# Altium project PMSM_G474.PrjPcb
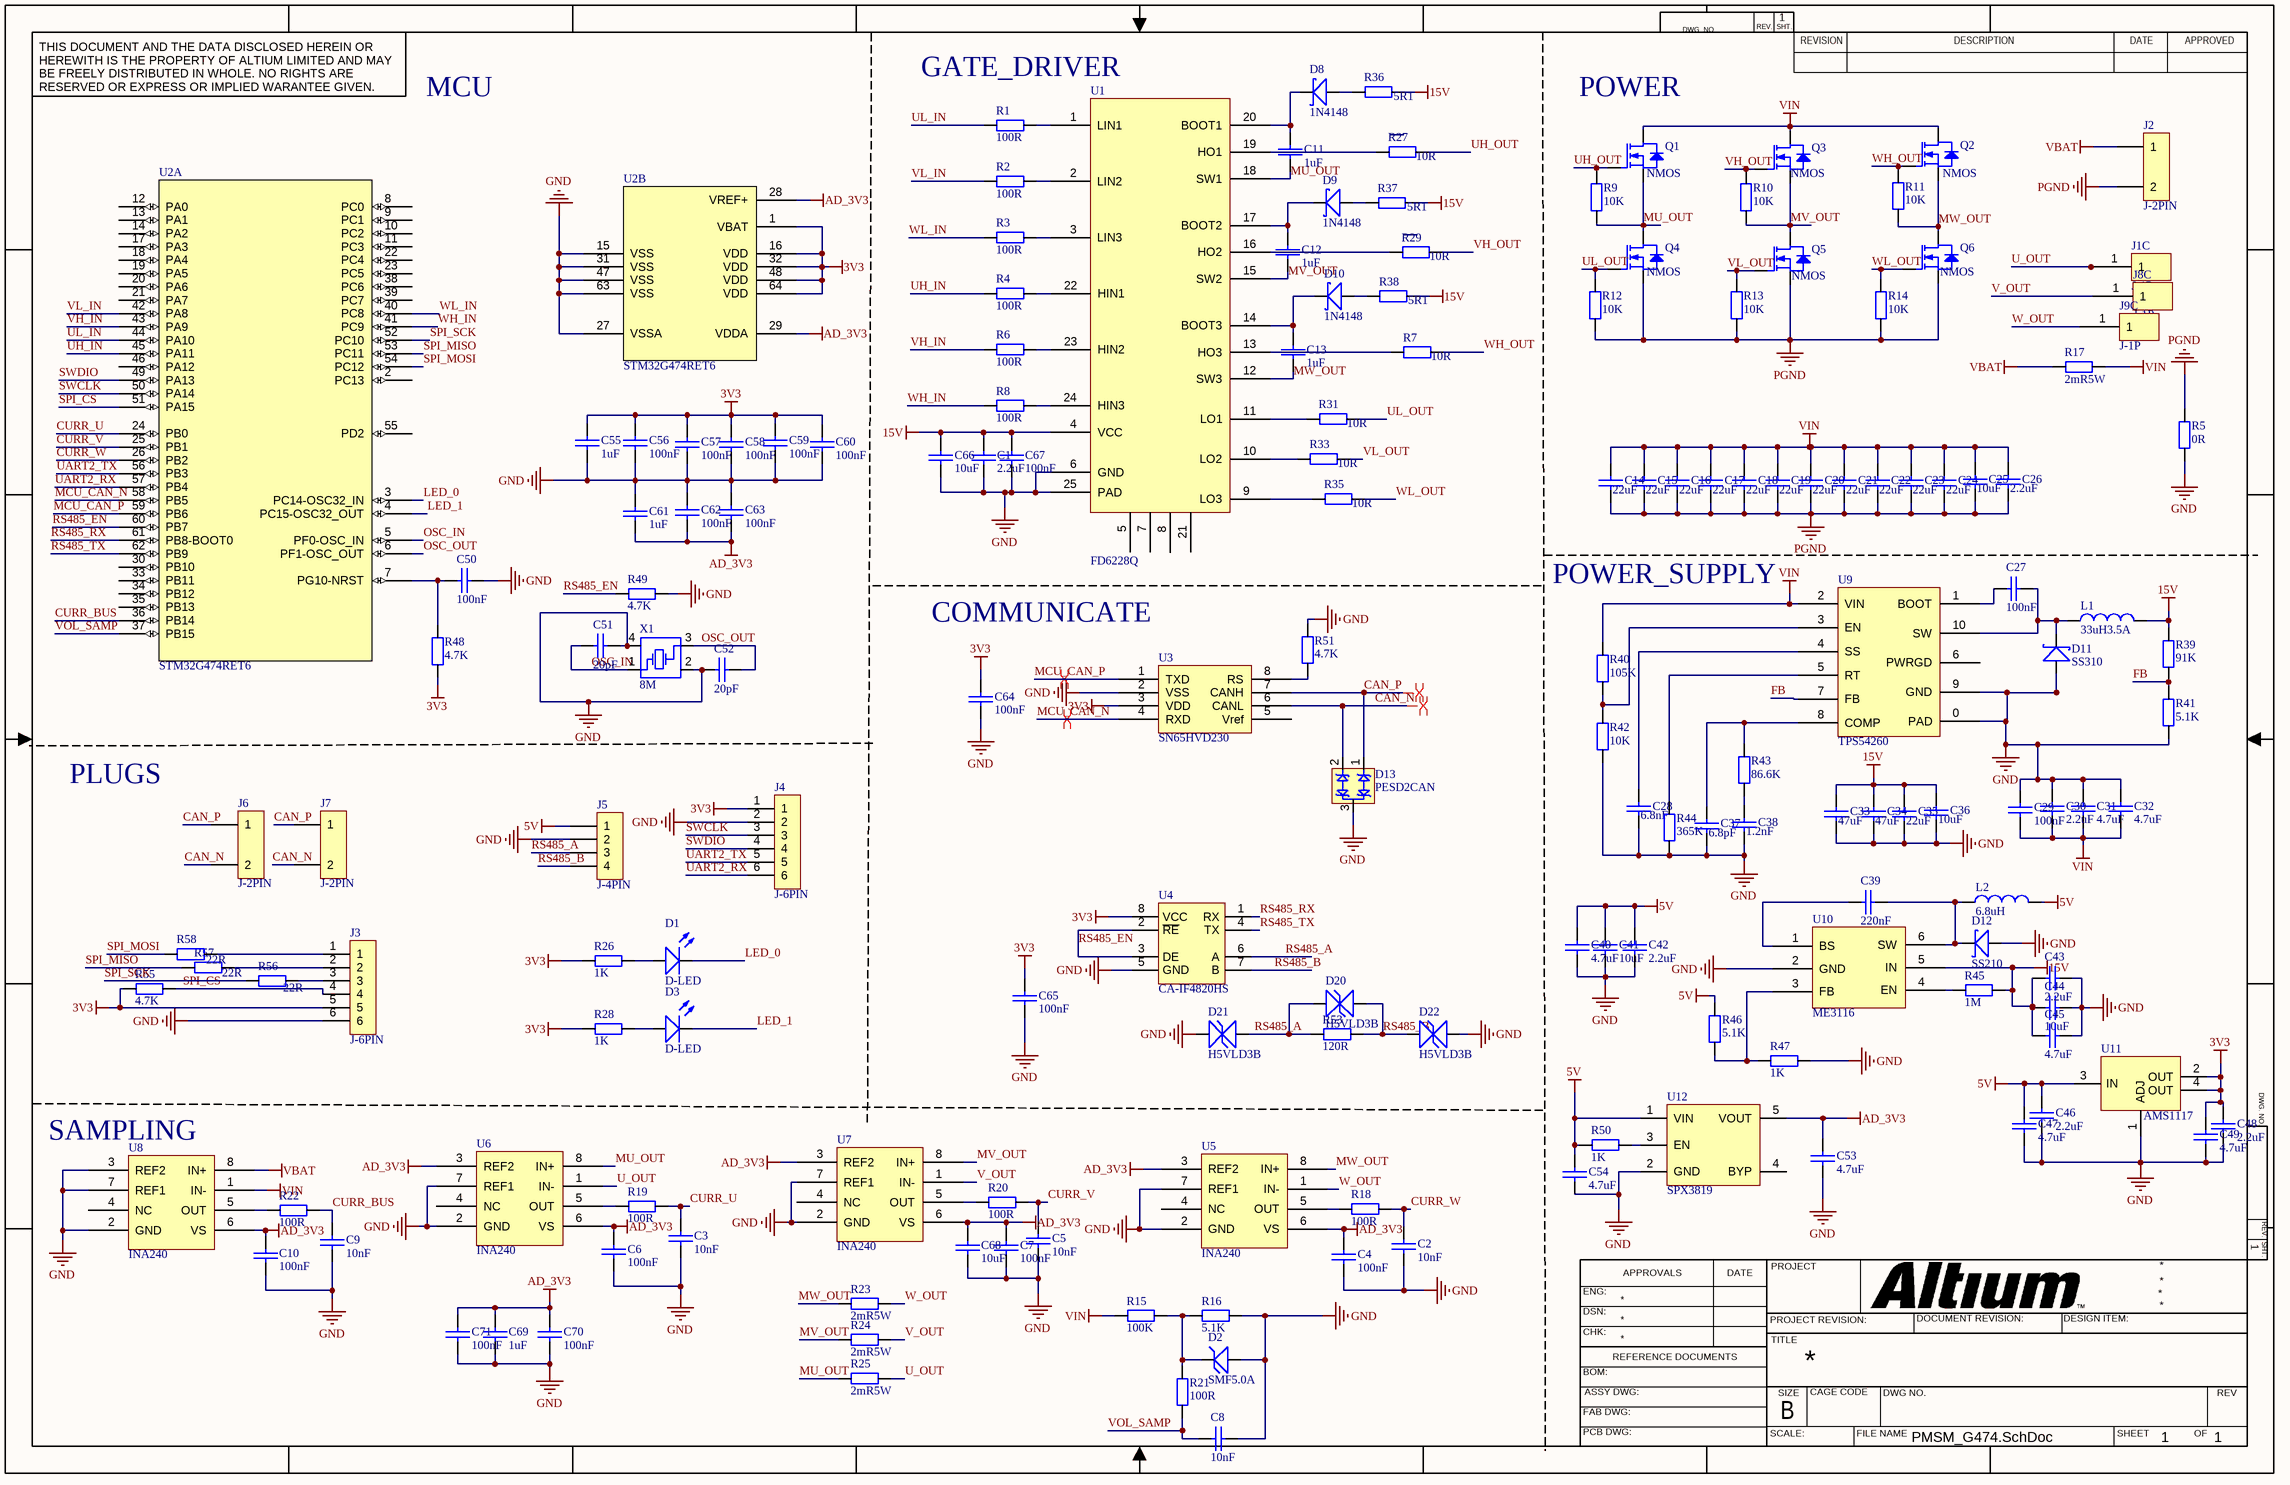
[diagram p0: PMSM_G474.SchDoc]
1 sheet, 166 parts. Net scope: global (net labels, ports and power ports of the same name join across sheets).
Board files: PMSM_G474.PcbDoc, PMSM_G474V1.0.PcbDoc

## Sheet PMSM_G474.SchDoc
size 431 x 279 mm; SheetNumber: 1; SheetTotal: 1

### Parts
C1  2.2uF  [C-0603]
C2  10nF  [C-0603]
C3  10nF  [C-0603]
C4  100nF  [C-0603]
C5  10nF  [C-0603]
C6  100nF  [C-0603]
C7  100nF  [C-0603]
C8  10nF  [C-0603]
C9  10nF  [C-0603]
C10  100nF  [C-0603]
C11  1uF  [C-0603]
C12  1uF  [C-0603]
C13  1uF  [C-0603]
C14  22uF  [C-1206]
C15  22uF  [C-1206]
C16  22uF  [C-1206]
C17  22uF  [C-1206]
C18  22uF  [C-1206]
C19  22uF  [C-1206]
C20  22uF  [C-1206]
C21  22uF  [C-1206]
C22  22uF  [C-1206]
C23  22uF  [C-1206]
C24  22uF  [C-1206]
C25  10uF  [C-1206]
C26  2.2uF  [C-1206]
C27  100nF  [C-0603]
C28  6.8nF  [C-0603]
C29  100nF  [C-0603]
C30  2.2uF  [C-1206]
C31  4.7uF  [C-1206]
C32  4.7uF  [C-1206]
C33  47uF  [C-1206]
C34  47uF  [C-1206]
C35  22uF  [C-1206]
C36  10uF  [C-1206]
C37  6.8pF  [C-0603]
C38  1.2nF  [C-0603]
C39  220nF  [C-0603]
C40  4.7uF  [C-1206]
C41  10uF  [C-1206]
C42  2.2uF  [C-1206]
C43  2.2uF  [C-1206]
C44  10uF  [C-1206]
C45  4.7uF  [C-1206]
C46  2.2uF  [C-0603]
C47  4.7uF  [C-0603]
C48  2.2uF  [C-0603]
C49  4.7uF  [C-0603]
C50  100nF  [C-0603]
C51  20pF  [C-0603]
C52  20pF  [C-0603]
C53  4.7uF  [C-0603]
C54  4.7uF  [C-0603]
C55  1uF  [C-0603]
C56  100nF  [C-0603]
C57  100nF  [C-0603]
C58  100nF  [C-0603]
C59  100nF  [C-0603]
C60  100nF  [C-0603]
C61  1uF  [C-0603]
C62  100nF  [C-0603]
C63  100nF  [C-0603]
C64  100nF  [C-0603]
C65  100nF  [C-0603]
C66  10uF  [C-0603]
C67  100nF  [C-0603]
C68  10uF  [C-0603]
C69  1uF  [C-0603]
C70  100nF  [C-0603]
C71  100nF  [C-0603]
D1  D-LED  [D-LED-0603Blue]
D2  SMF5.0A  [D-SOD-123]
D3  D-LED  [D-LED-0603Blue]
D8  1N4148  [D-SOD-123]
D9  1N4148  [D-SOD-123]
D10  1N4148  [D-SOD-123]
D11  SS310  [DO-214AC(SMA)]
D12  SS210  [DO-214AC(SMA)]
D13  PESD2CAN  [SOT-233]
D20  H5VLD3B  [D-SOD-323]
D21  H5VLD3B  [D-SOD-323]
D22  H5VLD3B  [D-SOD-323]
J1  J-1P  [PAD-1]  (part C of 3)
J2  J-2PIN  [J-XT30-2P-F]
J3  J-6PIN  [J-GH-6P]
J4  J-6PIN  [J-GH-6P]
J5  J-4PIN  [J-GH-4P]
J6  J-2PIN  [J-GH-2P]
J7  J-2PIN  [J-GH-2P]
J8  J-1P  [PAD-1]  (part C of 3)
J9  J-1P  [PAD-1]  (part C of 3)
L1  33uH3.5A  [L-SMD-7.0*7.0]
L2  6.8uH  [L-SMD-5.0*5.0*4.0]
Q1  NMOS  [SO-8FL  5*6]
Q2  NMOS  [SO-8FL  5*6]
Q3  NMOS  [SO-8FL  5*6]
Q4  NMOS  [SO-8FL  5*6]
Q5  NMOS  [SO-8FL  5*6]
Q6  NMOS  [SO-8FL  5*6]
R1  100R  [R-0603]
R2  100R  [R-0603]
R3  100R  [R-0603]
R4  100R  [R-0603]
R5  0R  [R-0603]
R6  100R  [R-0603]
R7  10R  [R-0603]
R8  100R  [R-0603]
R9  10K  [R-0603]
R10  10K  [R-0603]
R11  10K  [R-0603]
R12  10K  [R-0603]
R13  10K  [R-0603]
R14  10K  [R-0603]
R15  100K  [R-0603]
R16  5.1K  [R-0603]
R17  2mR5W  [R-2512]
R18  100R  [R-0603]
R19  100R  [R-0603]
R20  100R  [R-0603]
R21  100R  [R-0603]
R22  100R  [R-0603]
R23  2mR5W  [R-2512]
R24  2mR5W  [R-2512]
R25  2mR5W  [R-2512]
R26  1K  [R-0603]
R27  10R  [R-0603]
R28  1K  [R-0603]
R29  10R  [R-0603]
R31  10R  [R-0603]
R33  10R  [R-0603]
R35  10R  [R-0603]
R36  5R1  [R-0603]
R37  5R1  [R-0603]
R38  5R1  [R-0603]
R39  91K  [R-0603]
R40  105K  [R-0603]
R41  5.1K  [R-0603]
R42  10K  [R-0603]
R43  86.6K  [R-0603]
R44  365K  [R-0603]
R45  1M  [R-0603]
R46  5.1K  [R-0603]
R47  1K  [R-0603]
R48  4.7K  [R-0603]
R49  4.7K  [R-0603]
R50  1K  [R-0603]
R51  4.7K  [R-0603]
R53  120R  [R-0603]
R55  4.7K  [R-0603]
R56  22R  [R-0603]
R57  22R  [R-0603]
R58  22R  [R-0603]
U1  FD6228Q  [QFN-24-4X4]
U2  STM32G474RET6  [STM-LQFP64_N]  (parts A,B of 2)
U3  SN65HVD230  [SOp-8]
U4  CA-IF4820HS  [SOIC-8(4mm)]
U5  INA240  [SOIC-8(4mm)]
U6  INA240  [SOIC-8(4mm)]
U7  INA240  [SOIC-8(4mm)]
U8  INA240  [SOIC-8(4mm)]
U9  TPS54260  [MSOP-10]
U10  ME3116  [SOT-236]
U11  AMS1117  [SOT-89]
U12  SPX3819  [SOT-235]
X1  8M  [X-SMD-3225-4P]

### Nets
3V3: C48.2 C49.2 C55.1 C56.1 C57.1 C58.1 C59.1 C60.1 C64.1 C65.1 J3.5 J4.1 R26.2 R28.2 R48.1 R55.2 U2.1(VBAT) U2.16(VDD) U2.32(VDD) U2.48(VDD) U2.64(VDD) U3.3(VDD) U4.8(VCC) U11.2(OUT) U11.4(OUT)
5V: C40.1 C41.1 C42.1 C46.2 C47.2 C54.2 J5.1 L2.2 R46.2 R50.1 U11.3(IN) U12.1(VIN)
15V: C1.1 C33.1 C34.1 C35.1 C36.1 C43.1 C44.1 C45.1 C66.1 C67.1 L1.2 R36.2 R37.2 R38.2 R39.2 R45.2 U1.4(VCC) U10.5(IN)
AD_3V3: C4.1 C6.1 C7.1 C10.1 C53.2 C61.1 C62.1 C63.1 C68.1 C69.1 C70.1 C71.1 U2.28(VREF+) U2.29(VDDA) U5.3(REF2) U5.6(VS) U6.3(REF2) U6.6(VS) U7.3(REF2) U7.6(VS) U8.6(VS) U12.5(VOUT)
GND: C1.2 C2.2 C3.2 C4.2 C5.2 C6.2 C7.2 C8.2 C9.2 C10.2 C28.2 C29.2 C30.2 C31.2 C32.2 C33.2 C34.2 C35.2 C36.2 C37.2 C38.2 C40.2 C41.2 C42.2 C43.2 C44.2 C45.2 C46.1 C47.1 C48.1 C49.1 C50.2 C51.1 C52.1 C53.1 C54.1 C55.2 C56.2 C57.2 C58.2 C59.2 C60.2 C61.2 C62.2 C63.2 C64.2 C65.2 C66.2 C67.2 C68.2 C69.2 C70.2 C71.2 D2.1(A) D11.1 D12.1 D13.3 D21.1(A) D22.1(A) J3.6 J4.2 J5.2 R5.1 R16.1 R41.1 R42.1 R44.1 R47.2 R49.1 R51.2 U1.6(GND) U1.25(PAD) U2.15(VSS) U2.27(VSSA) U2.31(VSS) U2.47(VSS) U2.63(VSS) U3.2(VSS) U4.5(GND) U5.2(GND) U5.7(REF1) U6.2(GND) U6.7(REF1) U7.2(GND) U7.7(REF1) U8.2(GND) U8.3(REF2) U8.7(REF1) U9.0(PAD) U9.9(GND) U10.2(GND) U11.1(ADJ) U12.2(GND) X1.2(GND) X1.4(GND)
PGND: C14.2 C15.2 C16.2 C17.2 C18.2 C19.2 C20.2 C21.2 C22.2 C23.2 C24.2 C25.2 C26.2 J2.2 Q4.3(S) Q5.3(S) Q6.3(S) R5.2 R12.2 R13.2 R14.2
VBAT: J2.1 R17.1 U8.8(IN+)
VIN: C14.1 C15.1 C16.1 C17.1 C18.1 C19.1 C20.1 C21.1 C22.1 C23.1 C24.1 C25.1 C26.1 C29.1 C30.1 C31.1 C32.1 Q1.2(D) Q2.2(D) Q3.2(D) R15.2 R17.2 R40.2 U8.1(IN-) U9.2(VIN)
CAN_N: D13.2 J6.2 J7.2 U3.6(CANL)
CAN_P: D13.1 J6.1 J7.1 U3.7(CANH)
CURR_BUS: C9.1 R22.1 U2.36(PB14)
CURR_U: C3.1 R19.1 U2.24(PB0)
CURR_V: C5.1 R20.1 U2.25(PB1)
CURR_W: C2.1 R18.1 U2.26(PB2)
FB: R39.1 R41.2 U9.7(FB)
LED_0: D1.2 U2.3(PC14-OSC32_IN)
LED_1: D3.2 U2.4(PC15-OSC32_OUT)
MCU_CAN_N: U2.58(PB5) U3.4(RXD)
MCU_CAN_P: U2.59(PB6) U3.1(TXD)
MU_OUT: C11.2 Q1.3(S) Q4.2(D) R9.2 R25.1 U1.18(SW1) U6.8(IN+)
MV_OUT: C12.2 Q3.3(S) Q5.2(D) R10.2 R24.1 U1.15(SW2) U7.8(IN+)
MW_OUT: C13.2 Q2.3(S) Q6.2(D) R11.2 R23.1 U1.12(SW3) U5.8(IN+)
OSC_IN: C51.2 U2.5(PF0-OSC_IN) X1.1(OSC1)
OSC_OUT: C52.2 U2.6(PF1-OSC_OUT) X1.3(OSC2)
RS485_A: D20.1(A) D21.2(K) J5.3 R53.2 U4.6(A)
RS485_B: D20.2(K) D22.2(K) J5.4 R53.1 U4.7(B)
RS485_EN: R49.2 U2.60(PB7) U4.2(~{RE}) U4.3(DE)
RS485_RX: U2.61(PB8-BOOT0) U4.1(RX)
RS485_TX: U2.62(PB9) U4.4(TX)
SPI_CS: J3.4 R55.1 U2.51(PA15)
SPI_MISO: R57.2 U2.53(PC11)
SPI_MOSI: R58.2 U2.54(PC12)
SPI_SCK: R56.2 U2.52(PC10)
SWCLK: J4.3 U2.50(PA14)
SWDIO: J4.4 U2.49(PA13)
U_OUT: J1.1 R25.2 U6.1(IN-)
UART2_RX: J4.6 U2.57(PB4)
UART2_TX: J4.5 U2.56(PB3)
UH_IN: R4.2 U2.45(PA11)
UH_OUT: Q1.1(G) R9.1 R27.2
UL_IN: R1.2 U2.44(PA10)
UL_OUT: Q4.1(G) R12.1 R31.2
V_OUT: J8.1 R24.2 U7.1(IN-)
VH_IN: R6.2 U2.43(PA9)
VH_OUT: Q3.1(G) R10.1 R29.2
VL_IN: R2.2 U2.42(PA8)
VL_OUT: Q5.1(G) R13.1 R33.2
VOL_SAMP: C8.1 R21.2 U2.37(PB15)
W_OUT: J9.1 R23.2 U5.1(IN-)
WH_IN: R8.2 U2.41(PC9)
WH_OUT: Q2.1(G) R7.2 R11.1
WL_IN: R3.2 U2.40(PC8)
WL_OUT: Q6.1(G) R14.1 R35.2
NetC11_1: C11.1 D8.2 U1.20(BOOT1)
NetC12_1: C12.1 D9.2 U1.17(BOOT2)
NetC13_1: C13.1 D10.2 U1.14(BOOT3)
NetC27_1: C27.1 U9.1(BOOT)
NetC27_2: C27.2 D11.2 L1.1 U9.10(SW)
NetC28_1: C28.1 U9.4(SS)
NetC37_1: C37.1 R43.2 U9.8(COMP)
NetC38_1: C38.1 R43.1
NetC39_1: C39.1 U10.1(BS)
NetC39_2: C39.2 D12.2 L2.1 U10.6(SW)
NetC50_1: C50.1 R48.2 U2.7(PG10-NRST)
NetD1_1: D1.1 R26.1
NetD2_2: D2.2(K) R15.1 R16.2 R21.1
NetD3_1: D3.1 R28.1
NetD8_1: D8.1 R36.1
NetD9_1: D9.1 R37.1
NetD10_1: D10.1 R38.1
NetJ3_1: J3.1 R58.1
NetJ3_2: J3.2 R57.1
NetJ3_3: J3.3 R56.1
NetR1_1: R1.1 U1.1(LIN1)
NetR2_1: R2.1 U1.2(LIN2)
NetR3_1: R3.1 U1.3(LIN3)
NetR4_1: R4.1 U1.22(HIN1)
NetR6_1: R6.1 U1.23(HIN2)
NetR7_1: R7.1 U1.13(HO3)
NetR8_1: R8.1 U1.24(HIN3)
NetR18_2: R18.2 U5.5(OUT)
NetR19_2: R19.2 U6.5(OUT)
NetR20_2: R20.2 U7.5(OUT)
NetR22_2: R22.2 U8.5(OUT)
NetR27_1: R27.1 U1.19(HO1)
NetR29_1: R29.1 U1.16(HO2)
NetR31_1: R31.1 U1.11(LO1)
NetR33_1: R33.1 U1.10(LO2)
NetR35_1: R35.1 U1.9(LO3)
NetR40_1: R40.1 R42.2 U9.3(EN)
NetR44_2: R44.2 U9.5(RT)
NetR45_1: R45.1 U10.4(EN)
NetR46_1: R46.1 R47.1 U10.3(FB)
NetR50_2: R50.2 U12.3(EN)
NetR51_1: R51.1 U3.8(RS)

Not connected (* = marked no-connect by the designer): U1 5(NC) 7(NC) 8(NC) 21(NC); U2 2(PC13) 8(PC0) 9(PC1) 10(PC2) 11(PC3) 12(PA0) 13(PA1) 14(PA2) 17(PA3) 18(PA4) 19(PA5) 20(PA6) 21(PA7) 22(PC4) 23(PC5) 30(PB10) 33(PB11) 34(PB12) 35(PB13) 38(PC6) 39(PC7) 46(PA12) 55(PD2); U3 5(Vref); U5 4(NC); U6 4(NC); U7 4(NC); U8 4(NC); U9 6(PWRGD); U12 4(BYP)

### Layout directives
differential pair: CAN_N, CAN_P, MCU_CAN_N, MCU_CAN_P

### Notes on the sheet
- MCU
- GATE_DRIVER
- (near Q1) POWER
- COMMUNICATE
- POWER_SUPPLY
- PLUGS
- (near U8) SAMPLING
- DWG. NO.
- REV.
- SHT.
- THIS DOCUMENT AND THE DATA DISCLOSED HEREIN OR HEREWITH IS THE PROPERTY OF ALTIUM LIMITED AND MAY BE FREELY DISTRIBUTED IN WHOLE. NO RIGHTS ARE RESERVED OR EXPRESS OR IMPLIED WARANTEE GIVEN.
- REVISION
- DESCRIPTION
- DATE
- APPROVED
- ENG:
- APPROVALS
- PROJECT
- DSN:
- CHK:
- REFERENCE DOCUMENTS
- PROJECT REVISION:
- TITLE
- DOCUMENT REVISION:
- DESIGN ITEM:
- BOM:
- FAB DWG:
- PCB DWG:
- ASSY DWG:
- SCALE:
- SIZE
- B
- CAGE CODE
- FILE NAME
- DWG NO.
- SHEET
- OF
- REV

### Library data of the parts
C1-C71 = C: Non Polarised
D1 D3 = D-LED: LED
D2 = D-TVS-U: 单向TVS
D8-D12 = D-Schottky: Schottky
D13 = D-ESD: 组合ESD二极管
D20-D22 = D-TVS-B: 双向TVS
L1 L2 = L-SMD: Inductor
Q1-Q6 = NMOS: pin to pad: 1>4 2>5 3>1
R1-R29 R31 R33 R35-R51 R53 R55-R58 = R: Resistor
U1 = FD6228Q: 三相栅极驱动器
U2 = STM32G474RET6: ARM Cortex-M4 32-bit MCU+FPU, 512 kB Flash, 128 kB Internal RAM, 51 I/Os, 64-pin UFQFPN, -40 to 85 degC, Tray
U4 = CA-IF4820HS: 485 半双工 非隔离 ±15V共模 50M
U5-U8 = INA240: 具有PWM抑制功能的电流检测IC
U9 = TPS54260: 3.5V-60V 2A Step-Down DCDC Convertor
U10 = ME3116: DC-DC BUCK CONVERTER 40V VINmax 1A IOUTmax
U11 = AMS1117: LDO
U12 = SPX3819: LDO
X1 = Crystal-4p: Crystal Oscillator
J5 = J-4PIN: LatestRevisionDate: 17-Jul-2002; LatestRevisionNote: Re-released for DXP Platform.; Publisher: Altium Limited